# Altium schematic sheet Ethernet.SCHDOC: FPGA Rack
size 420 x 297 mm; DrawnBy: zas; Revision: V1.0; SheetNumber: 11; SheetTotal: 25; DocumentName: Ethernet.SCHDOC
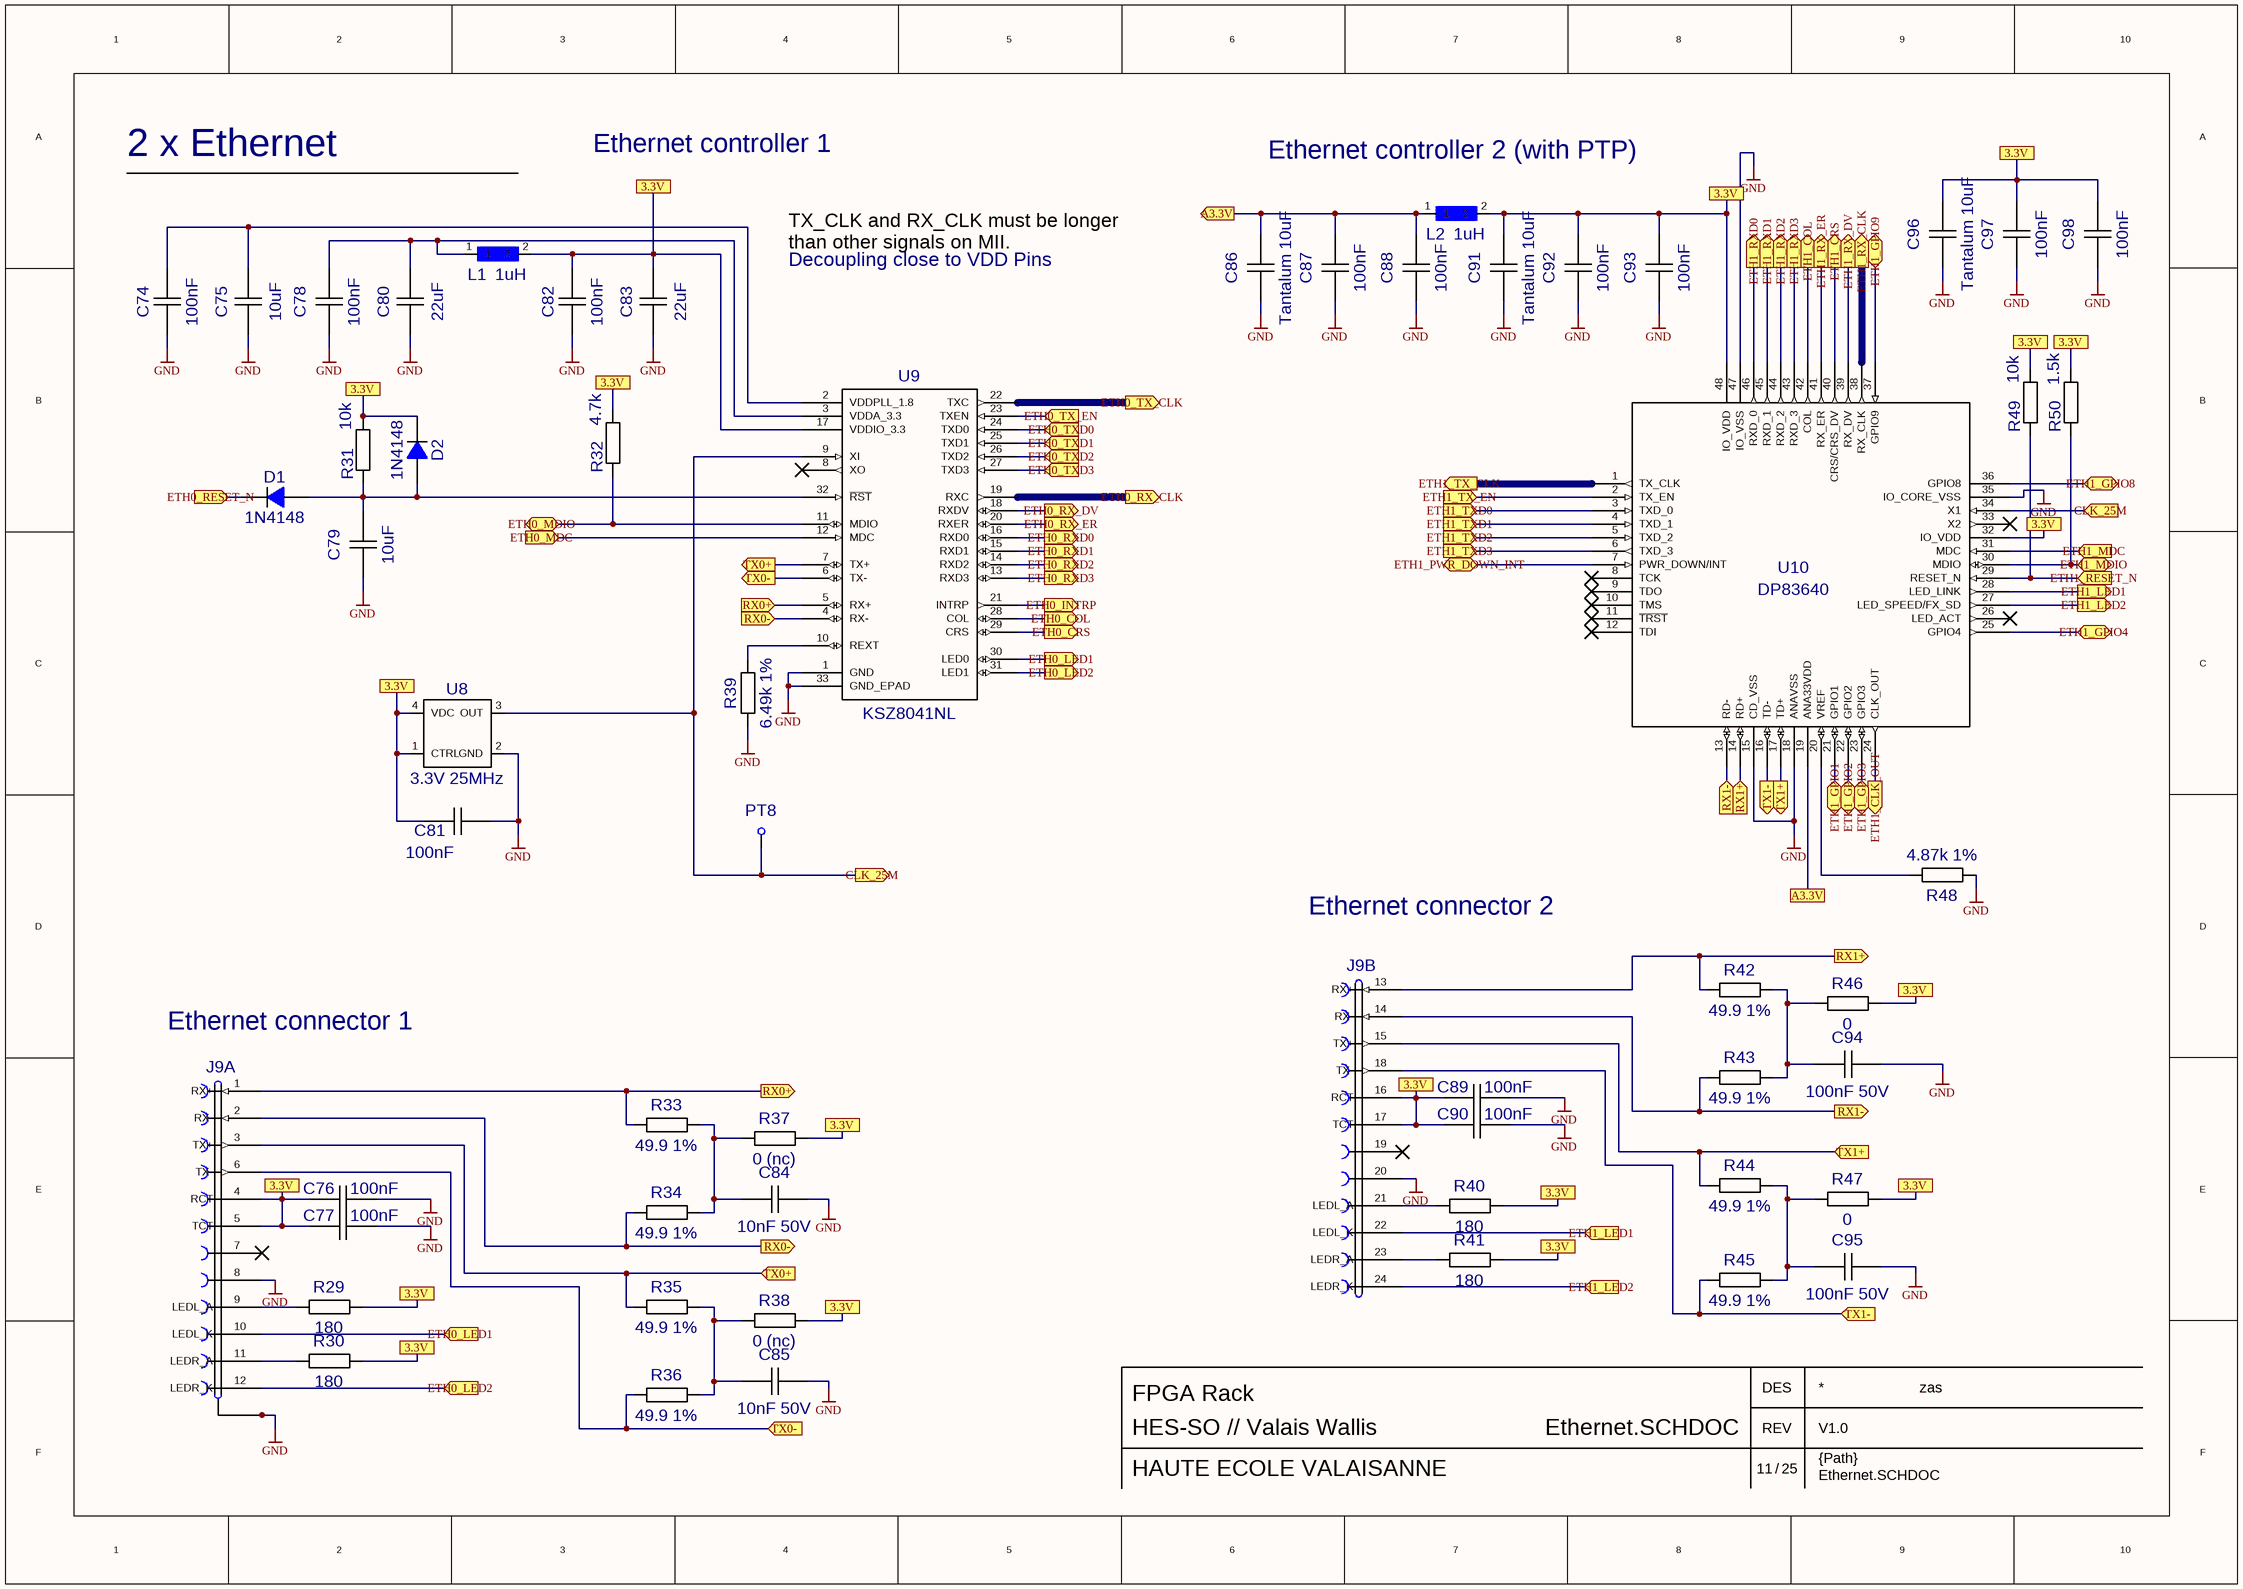
[diagram p0: Ethernet.SCHDOC]

## Parts
C74  value 100nF  [CC0805-MM]  (hidden comment: CAPS0805-MM)
C75  value 10uF  [CC0805-MM]  (hidden comment: CAPS0805-MM)
C76  value 100nF  [CC0805-MM]  (hidden comment: CAPS0805-MM)
C77  value 100nF  [CC0805-MM]  (hidden comment: CAPS0805-MM)
C78  value 100nF  [CC0805-MM]  (hidden comment: CAPS0805-MM)
C79  value 10uF  [CC0805-MM]  (hidden comment: CAPS0805-MM)
C80  value 22uF  [CC1206-MM]  (hidden comment: CAPS1206-MM)
C81  value 100nF  [CC0805-MM]  (hidden comment: CAPS0805-MM)
C82  value 100nF  [CC0805-MM]  (hidden comment: CAPS0805-MM)
C83  value 22uF  [CC1206-MM]  (hidden comment: CAPS1206-MM)
C84  value 10nF 50V  [CC0805-MM]  (hidden comment: CAPS0805-MM)
C85  value 10nF 50V  [CC0805-MM]  (hidden comment: CAPS0805-MM)
C86  value Tantalum 10uF  [CC0805-MM]  (hidden comment: CAPS0805-MM)
C87  value 100nF  [CC0805-MM]  (hidden comment: CAPS0805-MM)
C88  value 100nF  [CC0805-MM]  (hidden comment: CAPS0805-MM)
C89  value 100nF  [CC0805-MM]  (hidden comment: CAPS0805-MM)
C90  value 100nF  [CC0805-MM]  (hidden comment: CAPS0805-MM)
C91  value Tantalum 10uF  [CC0805-MM]  (hidden comment: CAPS0805-MM)
C92  value 100nF  [CC0805-MM]  (hidden comment: CAPS0805-MM)
C93  value 100nF  [CC0805-MM]  (hidden comment: CAPS0805-MM)
C94  value 100nF 50V  [CC0805-MM]  (hidden comment: CAPS0805-MM)
C95  value 100nF 50V  [CC0805-MM]  (hidden comment: CAPS0805-MM)
C96  value Tantalum 10uF  [CC0805-MM]  (hidden comment: CAPS0805-MM)
C97  value 100nF  [CC0805-MM]  (hidden comment: CAPS0805-MM)
C98  value 100nF  [CC0805-MM]  (hidden comment: CAPS0805-MM)
D1  value 1N4148  [SOT23]  (hidden comment: BAS16)
D2  value 1N4148  [SOT23]  (hidden comment: BAS16)
J9  RJ45-PULSE-J8064D628ANL  [RJ45-PULSE-J8064D628ANL]  (value not drawn)  (parts A,B of 2)
L1  value 1uH  [L0805-MM]  (hidden comment: L-0805-MM)
L2  value 1uH  [L0805-MM]  (hidden comment: L-0805-MM)
PT8  PTEST  [CONN1X1M]  (value not drawn)
R29  value 180  [RC0805-MM]  (hidden comment: RS0805-MM)
R30  value 180  [RC0805-MM]  (hidden comment: RS0805-MM)
R31  value 10k  [RC0805-MM]  (hidden comment: RS0805-MM)
R32  value 4.7k  [RC0805-MM]  (hidden comment: RS0805-MM)
R33  value 49.9 1%  [RC0805-MM]  (hidden comment: RS0805-MM)
R34  value 49.9 1%  [RC0805-MM]  (hidden comment: RS0805-MM)
R35  value 49.9 1%  [RC0805-MM]  (hidden comment: RS0805-MM)
R36  value 49.9 1%  [RC0805-MM]  (hidden comment: RS0805-MM)
R37  value 0 (nc)  [RC0805-MM]  (hidden comment: RS0805-MM)
R38  value 0 (nc)  [RC0805-MM]  (hidden comment: RS0805-MM)
R39  value 6.49k 1%  [RC0805-MM]  (hidden comment: RS0805-MM)
R40  value 180  [RC0805-MM]  (hidden comment: RS0805-MM)
R41  value 180  [RC0805-MM]  (hidden comment: RS0805-MM)
R42  value 49.9 1%  [RC0805-MM]  (hidden comment: RS0805-MM)
R43  value 49.9 1%  [RC0805-MM]  (hidden comment: RS0805-MM)
R44  value 49.9 1%  [RC0805-MM]  (hidden comment: RS0805-MM)
R45  value 49.9 1%  [RC0805-MM]  (hidden comment: RS0805-MM)
R46  value 0  [RC0805-MM]  (hidden comment: RS0805-MM)
R47  value 0  [RC0805-MM]  (hidden comment: RS0805-MM)
R48  value 4.87k 1%  [RC0805-MM]  (hidden comment: RS0805-MM)
R49  value 10k  [RC0805-MM]  (hidden comment: RS0805-MM)
R50  value 1.5k  [RC0805-MM]  (hidden comment: RS0805-MM)
U8  value 3.3V 25MHz  [OSCILL-VX3]  (hidden comment: OSCILL-VX3)
U9  KSZ8041NL  [QFN32 5X5]
U10  DP83640  [LQFP48-P0.5-L7-C7]

## Ports
3.3V, A3.3V, A3.3V (out), CLK_25M (in), CLK_25M (out), ETH0_COL (out), ETH0_CRS (out), ETH0_INTRP (out), ETH0_LED1 (in), ETH0_LED1 (out), ETH0_LED2 (in), ETH0_LED2 (out), ETH0_MDC (in), ETH0_MDIO (bidir), ETH0_RESET_N (in), ETH0_RX_CLK (out), ETH0_RX_DV (out), ETH0_RX_ER (out), ETH0_RXD0 (out), ETH0_RXD1 (out), ETH0_RXD2 (out), ETH0_RXD3 (out), ETH0_TX_CLK (out), ETH0_TX_EN (in), ETH0_TXD0 (in), ETH0_TXD1 (in), ETH0_TXD2 (in), ETH0_TXD3 (in), ETH1_CLK_OUT (out), ETH1_COL (out), ETH1_CRS (out), ETH1_GPIO1 (bidir), ETH1_GPIO2 (bidir), ETH1_GPIO3 (bidir), ETH1_GPIO4 (bidir), ETH1_GPIO8 (bidir), ETH1_GPIO9 (bidir), ETH1_LED1 (in), ETH1_LED1 (out), ETH1_LED2 (in), ETH1_LED2 (out), ETH1_MDC (in), ETH1_MDIO (bidir), ETH1_PWR_DOWN_INT (bidir), ETH1_RESET_N (in), ETH1_RX_CLK (out), ETH1_RX_DV (out), ETH1_RX_ER (out), ETH1_RXD0 (out), ETH1_RXD1 (out), ETH1_RXD2 (out), ETH1_RXD3 (out), ETH1_TX_CLK (out), ETH1_TX_EN (in), ETH1_TXD0 (in), ETH1_TXD1 (in), ETH1_TXD2 (in), ETH1_TXD3 (in), RX0+ (in), RX0+ (out), RX0- (in), RX0- (out), RX1+ (in), RX1+ (out), RX1- (in), RX1- (out), TX0+ (in), TX0+ (out), TX0- (in), TX0- (out), TX1+ (in), TX1+ (out), TX1- (in), TX1- (out)

## Nets
GND: C74.1 C75.1 C76.2 C77.2 C78.1 C79.1 C80.1 C81.2 C82.1 C83.1 C84.2 C85.2 C86.1 C87.1 C88.1 C89.2 C90.2 C91.1 C92.1 C93.1 C94.2 C95.2 C96.1 C97.1 C98.1 J9.8 J9.20 J9.25 J9.26 J9.27 R39.1 R48.1 U8.2(GND) U9.1(GND) U9.33(GND_EPAD) U10.15(CD_VSS) U10.18(ANAVSS) U10.35(IO_CORE_VSS) U10.47(IO_VSS)
A3.3V: C86.2 C87.2 C88.2 L2.1 ; port A3.3V
CLK_25M: PT8.1(A) U8.3(OUT) U9.9(XI) U10.34(X1) ; port CLK_25M
ETH0_COL: U9.28(COL) ; port ETH0_COL
ETH0_CRS: U9.29(CRS) ; port ETH0_CRS
ETH0_INTRP: U9.21(INTRP) ; port ETH0_INTRP
ETH0_LED1: J9.10(LEDL_K) U9.30(LED0) ; port ETH0_LED1
ETH0_LED2: J9.12(LEDR_K) U9.31(LED1) ; port ETH0_LED2
ETH0_MDC: U9.12(MDC) ; port ETH0_MDC
ETH0_MDIO: R32.1 U9.11(MDIO) ; port ETH0_MDIO
ETH0_RESET_N: D1.3(K) ; port ETH0_RESET_N
ETH0_RX_CLK: U9.19(RXC) ; port ETH0_RX_CLK
ETH0_RX_DV: U9.18(RXDV) ; port ETH0_RX_DV
ETH0_RX_ER: U9.20(RXER) ; port ETH0_RX_ER
ETH0_RXD0: U9.16(RXD0) ; port ETH0_RXD0
ETH0_RXD1: U9.15(RXD1) ; port ETH0_RXD1
ETH0_RXD2: U9.14(RXD2) ; port ETH0_RXD2
ETH0_RXD3: U9.13(RXD3) ; port ETH0_RXD3
ETH0_TX_CLK: U9.22(TXC) ; port ETH0_TX_CLK
ETH0_TX_EN: U9.23(TXEN) ; port ETH0_TX_EN
ETH0_TXD0: U9.24(TXD0) ; port ETH0_TXD0
ETH0_TXD1: U9.25(TXD1) ; port ETH0_TXD1
ETH0_TXD2: U9.26(TXD2) ; port ETH0_TXD2
ETH0_TXD3: U9.27(TXD3) ; port ETH0_TXD3
ETH1_CLK_OUT: U10.24(CLK_OUT) ; port ETH1_CLK_OUT
ETH1_COL: U10.42(COL) ; port ETH1_COL
ETH1_CRS: U10.40(CRS/CRS_DV) ; port ETH1_CRS
ETH1_GPIO1: U10.21(GPIO1) ; port ETH1_GPIO1
ETH1_GPIO2: U10.22(GPIO2) ; port ETH1_GPIO2
ETH1_GPIO3: U10.23(GPIO3) ; port ETH1_GPIO3
ETH1_GPIO4: U10.25(GPIO4) ; port ETH1_GPIO4
ETH1_GPIO8: U10.36(GPIO8) ; port ETH1_GPIO8
ETH1_GPIO9: U10.37(GPIO9) ; port ETH1_GPIO9
ETH1_LED1: J9.22(LEDL_K) U10.28(LED_LINK) ; port ETH1_LED1
ETH1_LED2: J9.24(LEDR_K) U10.27(LED_SPEED/FX_SD) ; port ETH1_LED2
ETH1_MDC: U10.31(MDC) ; port ETH1_MDC
ETH1_MDIO: R50.1 U10.30(MDIO) ; port ETH1_MDIO
ETH1_PWR_DOWN_INT: U10.7(PWR_DOWN/INT) ; port ETH1_PWR_DOWN_INT
ETH1_RESET_N: R49.1 U10.29(RESET_N) ; port ETH1_RESET_N
ETH1_RX_CLK: U10.38(RX_CLK) ; port ETH1_RX_CLK
ETH1_RX_DV: U10.39(RX_DV) ; port ETH1_RX_DV
ETH1_RX_ER: U10.41(RX_ER) ; port ETH1_RX_ER
ETH1_RXD0: U10.46(RXD_0) ; port ETH1_RXD0
ETH1_RXD1: U10.45(RXD_1) ; port ETH1_RXD1
ETH1_RXD2: U10.44(RXD_2) ; port ETH1_RXD2
ETH1_RXD3: U10.43(RXD_3) ; port ETH1_RXD3
ETH1_TX_CLK: U10.1(TX_CLK) ; port ETH1_TX_CLK
ETH1_TX_EN: U10.2(TX_EN) ; port ETH1_TX_EN
ETH1_TXD0: U10.3(TXD_0) ; port ETH1_TXD0
ETH1_TXD1: U10.4(TXD_1) ; port ETH1_TXD1
ETH1_TXD2: U10.5(TXD_2) ; port ETH1_TXD2
ETH1_TXD3: U10.6(TXD_3) ; port ETH1_TXD3
RX0+: J9.1(RX+) R33.1 U9.5(RX+) ; port RX0+
RX0-: J9.2(RX-) R34.1 U9.4(RX-) ; port RX0-
RX1+: J9.13(RX+) R42.1 U10.14(RD+) ; port RX1+
RX1-: J9.14(RX-) R43.1 U10.13(RD-) ; port RX1-
TX0+: J9.3(TX+) R35.1 U9.7(TX+) ; port TX0+
TX0-: J9.6(TX-) R36.1 U9.6(TX-) ; port TX0-
TX1+: J9.15(TX+) R44.1 U10.17(TD+) ; port TX1+
TX1-: J9.18(TX-) R45.1 U10.16(TD-) ; port TX1-
NetC74_2: C74.2 C75.2 U9.2(VDDPLL_1.8)
NetC76_1: C76.1 C77.1 J9.4(RCT) J9.5(TCT)
NetC78_2: C78.2 C80.2 L1.1 U9.3(VDDA_3.3)
NetC79_2: C79.2 D1.1(A) D2.1(A) R31.1 U9.32(~{RST})
NetC81_1: C81.1 U8.1(CTRL) U8.4(VDC)
NetC82_2: C82.2 C83.2 L1.2 U9.17(VDDIO_3.3)
NetC84_1: C84.1 R33.2 R34.2 R37.1
NetC85_1: C85.1 R35.2 R36.2 R38.1
NetC89_1: C89.1 C90.1 J9.16(RCT) J9.17(TCT)
NetC91_2: C91.2 C92.2 C93.2 L2.2 U10.48(IO_VDD)
NetC94_1: C94.1 R42.2 R43.2 R46.1
NetC95_1: C95.1 R44.2 R45.2 R47.1
NetC96_2: C96.2 C97.2 C98.2
NetD2_3: D2.3(K) R31.2
NetJ9_9: J9.9(LEDL_A) R29.1
NetJ9_11: J9.11(LEDR_A) R30.1
NetJ9_21: J9.21(LEDL_A) R40.1
NetJ9_23: J9.23(LEDR_A) R41.1
NetR39_2: R39.2 U9.10(REXT)
NetR48_2: R48.2 U10.20(VREF)

Not connected (* = marked no-connect by the designer): D1 2(NC); D2 2(NC); J9 7 19 28 29; R29 2; R30 2; R32 2; R37 2; R38 2; R40 2; R41 2; R46 2; R47 2; R49 2; R50 2; U9 8(XO); U10 8(TCK) 9(TDO) 10(TMS) 11(~{TRST}) 12(TDI) 19(ANA33VDD) 26(LED_ACT) 32(IO_VDD) 33(X2)

## Notes on the sheet
- 2 x Ethernet
- Ethernet controller 1
- (near L2) Ethernet controller 2 (with PTP)
- TX_CLK and RX_CLK must be longer
  than other signals on MII.
- Decoupling close to VDD Pins
- Ethernet connector 2
- Ethernet connector 1
- DES
- HES-SO // Valais Wallis
- HAUTE ECOLE VALAISANNE
- /
- REV
- {Path}

## Library data of the parts
C74 C75 C78 C79 C81 C82 C84-C88 C91-C98 = CAPS0805-MM: Capacitor
C76 C77 C89 C90 = CAPS0805-MM: Capacitor; Partition: Shared IOs; RefDes2: {RefDes2}
C80 C83 = CAPS1206-MM: Capacitor
J9 = RJ45-PULSE-J8064D628ANL: Integrated connector modules 10/100 base-TX belMag with LEDs .  Reselec N° 0810-1X1T-03
L1 L2 = L-0805-MM: Self de choc SMD - Murata
PT8 = PTEST_VARIANT_1: Partition: Power; RefDes2: {RefDes2}; Value: *
R31 R32 R49 R50 = RS0805-MM: Partition: FPGA Config; RefDes2: {RefDes2}; MEZZAONLY: YES
R39 = RS0805-MM: Resistor
U8 = OSCILL-VX3: Oscillator serie VX3 - Jauch - Distrelec 68 03 82 .. 68 04 00
U9 = KSZ8041NL: Quadrature Decoder/Counter interface ICs - Agilent Technologies
U10 = DP83640: Value: *